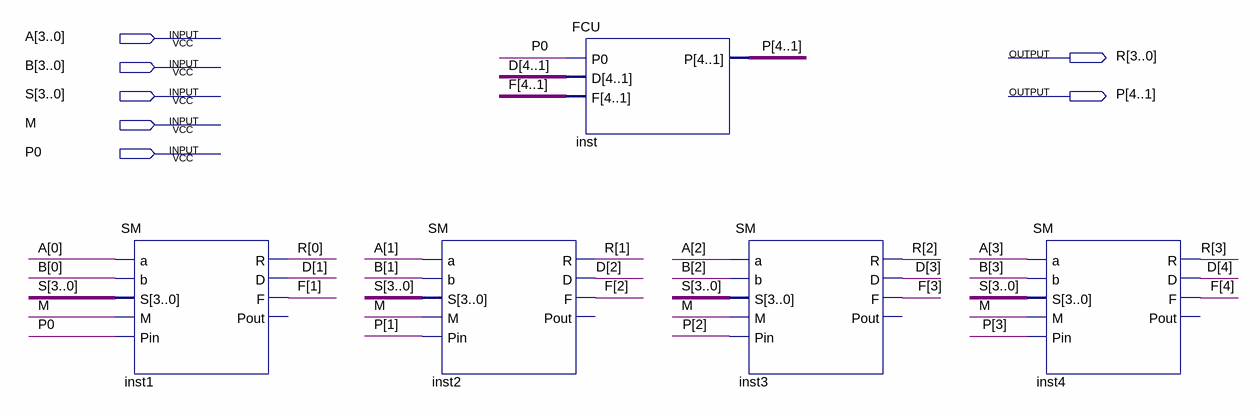
[diagram p0: schematic sheet]
// Quartus schematic ALU_ParallelCarry.bdf as structural Verilog: 5 symbols, 7 pins
module ALU_ParallelCarry (
  input  [3:0] A,
  input  [3:0] B,
  input  [3:0] S,
  input  M,
  input  P0,
  output [3:0] R,
  output [4:1] P
);

  wire [4:1] D, F;

  SM inst1 (.a(A[0]), .b(B[0]), .S(S), .M(M), .Pin(P0), .R(R[0]), .D(D[1]), .F(F[1]));  // open: Pout
  SM inst2 (.a(A[1]), .b(B[1]), .S(S), .M(M), .Pin(P[1]), .R(R[1]), .D(D[2]), .F(F[2]));  // open: Pout
  FCU inst (.P0(P0), .D(D), .F(F), .P(P));
  SM inst3 (.a(A[2]), .b(B[2]), .S(S), .M(M), .Pin(P[2]), .R(R[2]), .D(D[3]), .F(F[3]));  // open: Pout
  SM inst4 (.a(A[3]), .b(B[3]), .S(S), .M(M), .Pin(P[3]), .R(R[3]), .D(D[4]), .F(F[4]));  // open: Pout
endmodule
